# EAGLE design x50_dash (EAGLE 9.2.2)
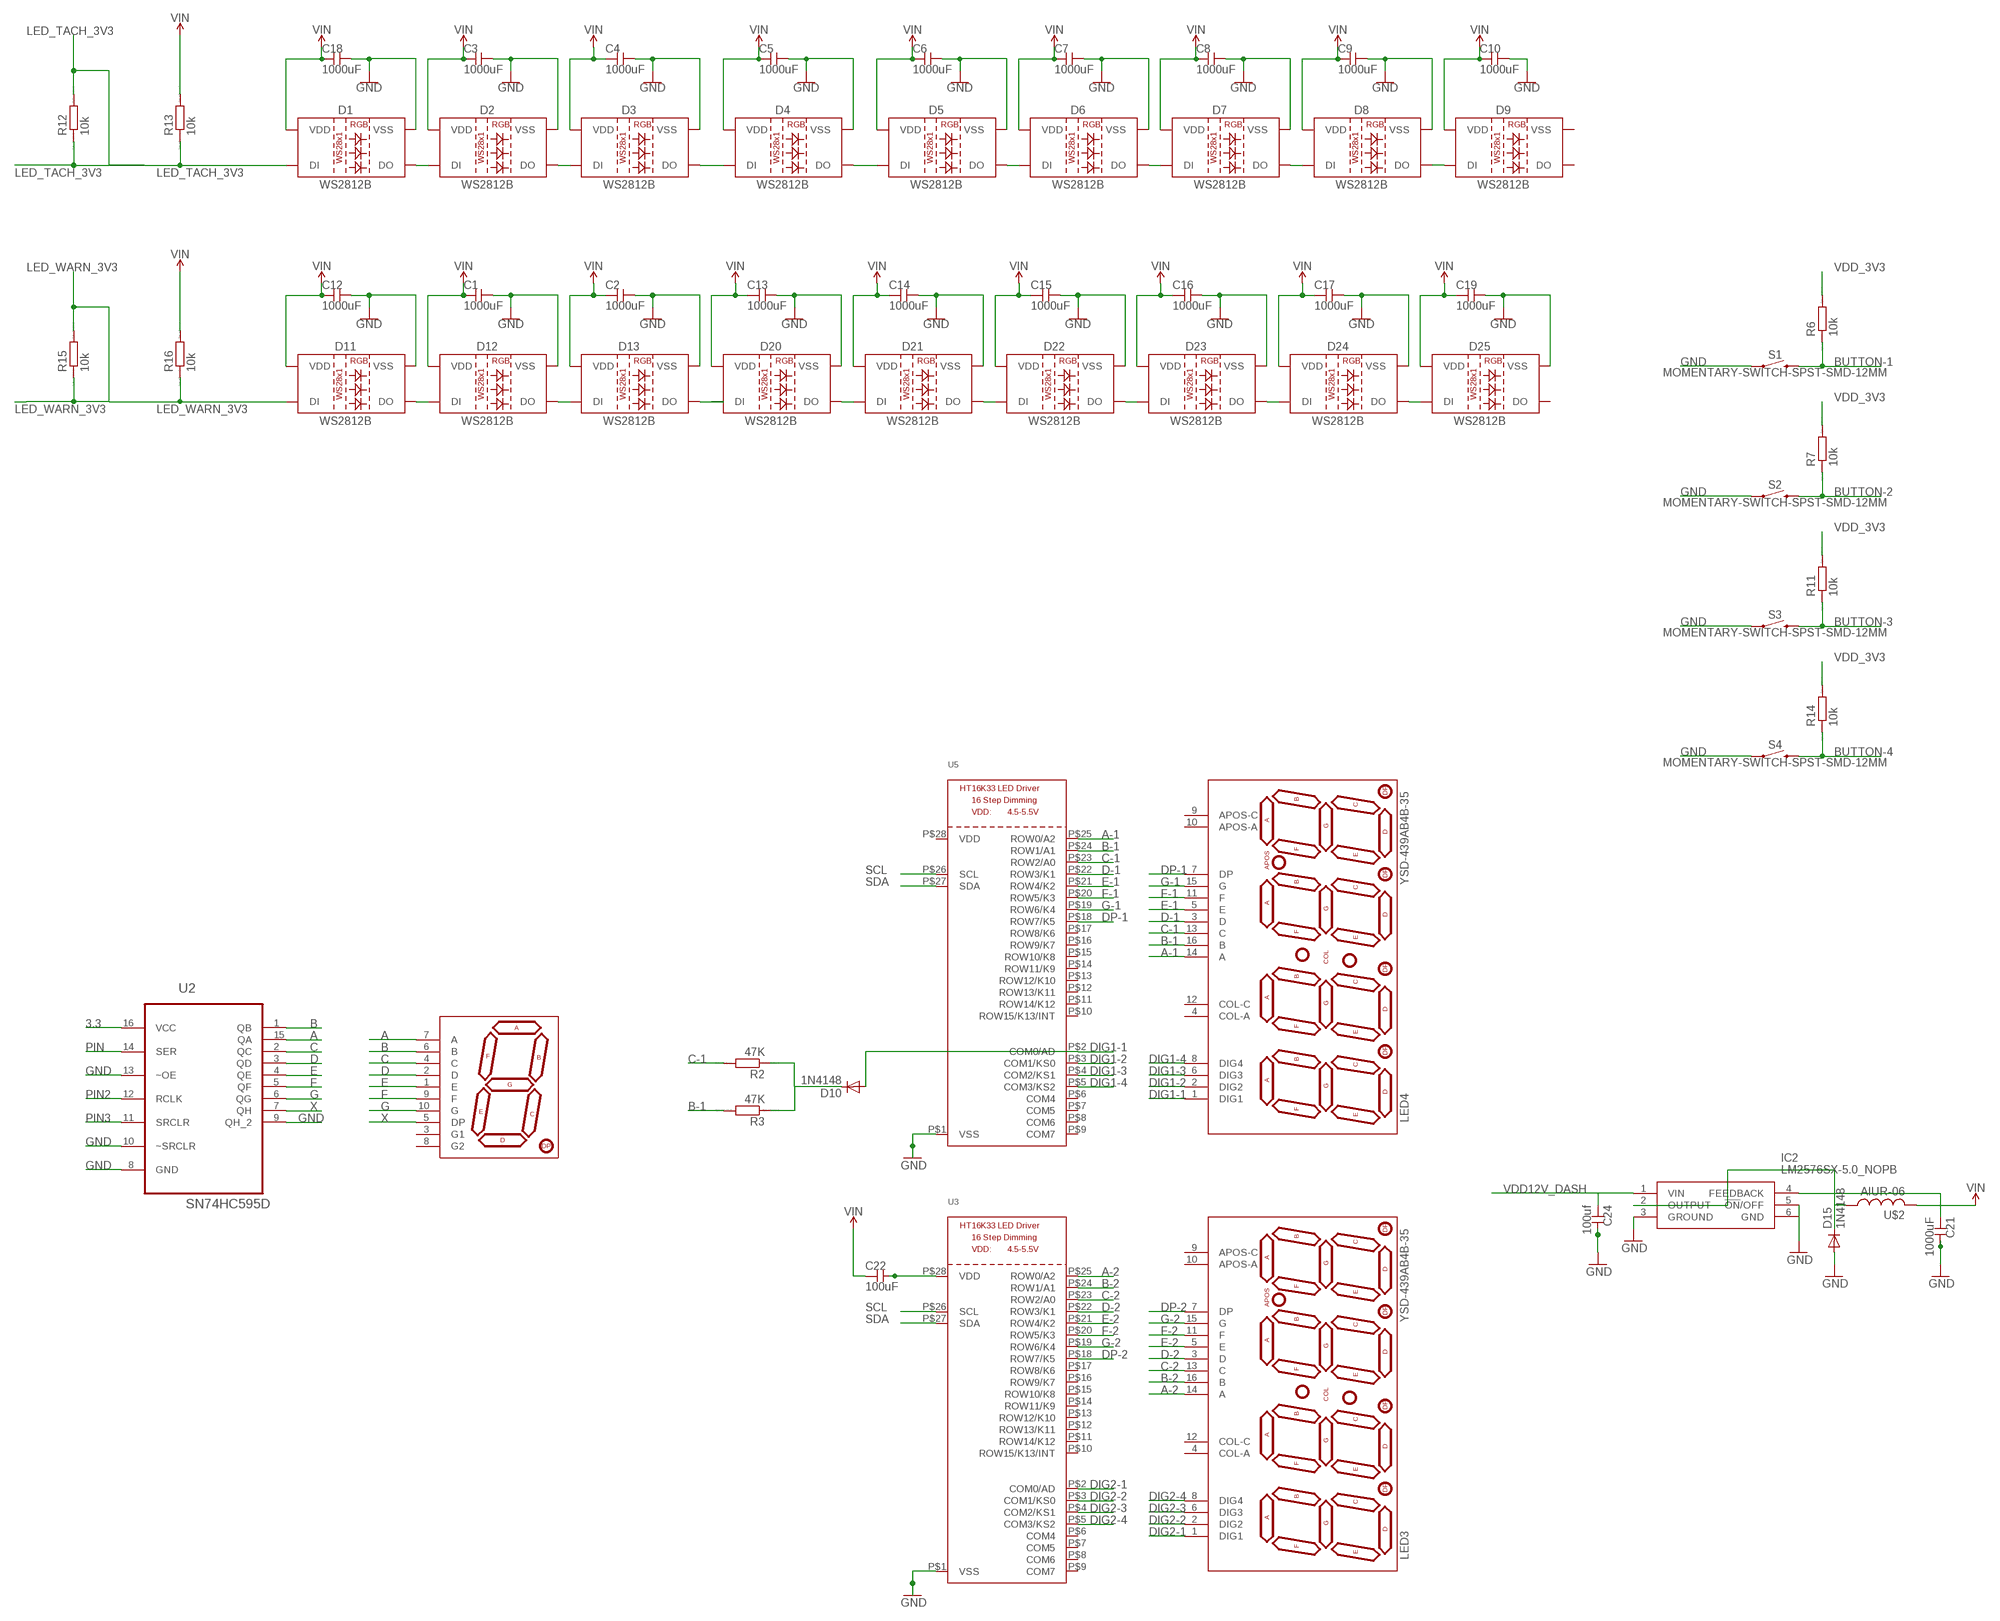
[diagram p0: schematic, sheet 1, part 1 of 2]
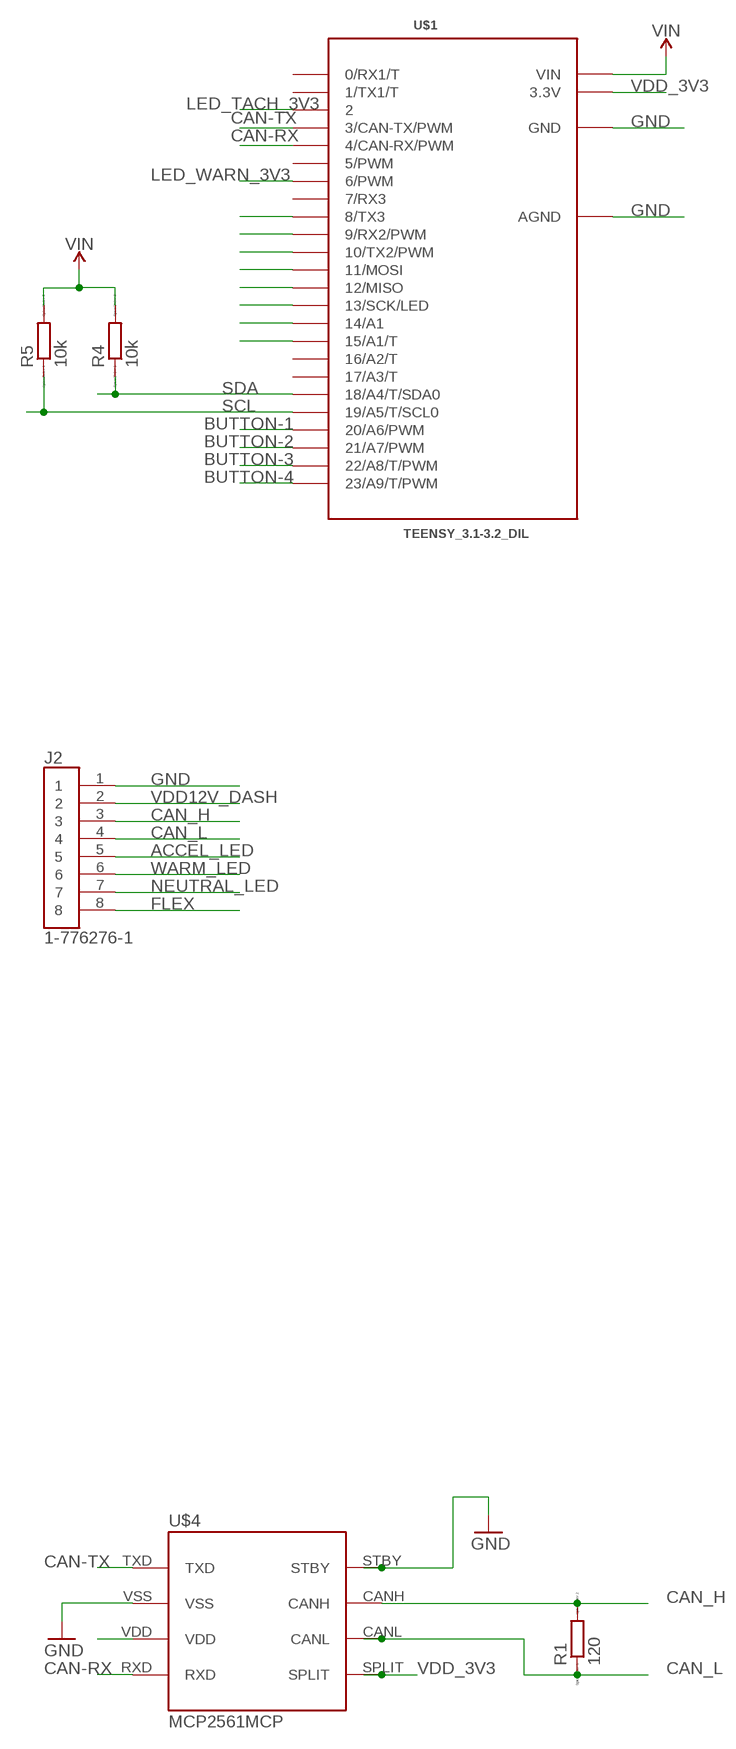
[diagram p1: schematic, sheet 1, part 2 of 2]

## Parts
C1  1000uF  CAP-1005  [1005]
C2  1000uF  CAP-1005  [1005]
C3  1000uF  CAP-1005  [1005]
C4  1000uF  CAP-1005  [1005]
C5  1000uF  CAP-1005  [1005]
C6  1000uF  CAP-1005  [1005]
C7  1000uF  CAP-1005  [1005]
C8  1000uF  CAP-1005  [1005]
C9  1000uF  CAP-1005  [1005]
C10  1000uF  CAP-1005  [1005]
C12  1000uF  CAP-1005  [1005]
C13  1000uF  CAP-1005  [1005]
C14  1000uF  CAP-1005  [1005]
C15  1000uF  CAP-1005  [1005]
C16  1000uF  CAP-1005  [1005]
C17  1000uF  CAP-1005  [1005]
C18  1000uF  CAP-1005  [1005]
C19  1000uF  CAP-1005  [1005]
C21  1000uF  CAP-1005  [1005]
C22  100uF  CAP-1005  [1005]
C24  100uf  CAP-1005  [1005]
D1  WS2812B  [WS2812B]
D2  WS2812B  [WS2812B]
D3  WS2812B  [WS2812B]
D4  WS2812B  [WS2812B]
D5  WS2812B  [WS2812B]
D6  WS2812B  [WS2812B]
D7  WS2812B  [WS2812B]
D8  WS2812B  [WS2812B]
D9  WS2812B  [WS2812B]
D10  1N4148  [DO35-10]
D11  WS2812B  [WS2812B]
D12  WS2812B  [WS2812B]
D13  WS2812B  [WS2812B]
D15  1N4148  [DO35-10]
D20  WS2812B  [WS2812B]
D21  WS2812B  [WS2812B]
D22  WS2812B  [WS2812B]
D23  WS2812B  [WS2812B]
D24  WS2812B  [WS2812B]
D25  WS2812B  [WS2812B]
IC2  LM2576SX-5.0_NOPB  [KTT0005B]
J2  1-776276-1  [TE_1-776276-1]
LED3  YSD-439AB4B-35  7-SEGMENT-4DIGIT-10MM-BLUE  [7-SEGMENT-4DIGIT-YOUNGSUN]
LED4  YSD-439AB4B-35  7-SEGMENT-4DIGIT-10MM-BLUE  [7-SEGMENT-4DIGIT-YOUNGSUN]
R1  120  R  [R0805]
R2  47K  R  [R0805]
R3  47K  R  [R0805]
R4  10k  R  [R0805]
R5  10k  R  [R0805]
R6  10k  R  [R0805]
R7  10k  R  [R0805]
R11  10k  R  [R0805]
R12  10k  R  [R0805]
R13  10k  R  [R0805]
R14  10k  R  [R0805]
R15  10k  R  [R0805]
R16  10k  R  [R0805]
S1  MOMENTARY-SWITCH-SPST-SMD-12MM  [TACTILE_SWITCH_SMD_12MM]
S2  MOMENTARY-SWITCH-SPST-SMD-12MM  [TACTILE_SWITCH_SMD_12MM]
S3  MOMENTARY-SWITCH-SPST-SMD-12MM  [TACTILE_SWITCH_SMD_12MM]
S4  MOMENTARY-SWITCH-SPST-SMD-12MM  [TACTILE_SWITCH_SMD_12MM]
U2  SN74HC595D  [SOIC127P600X175-16N]
U3  HT16K33_SOP28  [SOP28_300MIL]
U5  HT16K33_SOP28  [SOP28_300MIL]
U$1  TEENSY_3.1-3.2_DIL  [TEENSY_3.0-3.2&LC_DIL]
U$2  AIUR-06  [AIUR-06]
U$4  MCP2561MCP  [MCP2561_PDIP]
U$5  YSD-160AB3C-8  7-SEGMENT-1DIGIT-1INCH-BLUE  [7-SEGMENT-1"PTH]

## Nets
3.3: U2.16(VCC)
A: U2.15(QA) U$5.7(A)
A-1: LED4.14(A) U5.P$25(ROW0/A2)
A-2: LED3.14(A) U3.P$25(ROW0/A2)
ACCEL_LED: J2.5
B: U2.1(QB) U$5.6(B)
B-1: LED4.16(B) R3.2 U5.P$24(ROW1/A1)
B-2: LED3.16(B) U3.P$24(ROW1/A1)
BUTTON-1: R6.1 S1.3 U$1.20/A6(20/A6/PWM)
BUTTON-2: R7.1 S2.3 U$1.21/A7(21/A7/PWM)
BUTTON-3: R11.1 S3.3 U$1.22/A8(22/A8/T/PWM)
BUTTON-4: R14.1 S4.3 U$1.23/A9(23/A9/T/PWM)
C: U2.2(QC) U$5.4(C)
C-1: LED4.13(C) R2.2 U5.P$23(ROW2/A0)
C-2: LED3.13(C) U3.P$23(ROW2/A0)
CAN-RX: U$1.4(4/CAN-RX/PWM) U$4.RXD U$4.VDD
CAN-TX: U$1.3(3/CAN-TX/PWM) U$4.TXD
CAN_H: J2.3 R1.2 U$4.CANH
CAN_L: J2.4 R1.1 U$4.CANL
D: U2.3(QD) U$5.2(D)
D-1: LED4.3(D) U5.P$22(ROW3/K1)
D-2: LED3.3(D) U3.P$22(ROW3/K1)
DIG1-1: D10.A LED4.1(DIG1) U5.P$2(COM0/AD)
DIG1-2: LED4.2(DIG2) U5.P$3(COM1/KS0)
DIG1-3: LED4.6(DIG3) U5.P$4(COM2/KS1)
DIG1-4: LED4.8(DIG4) U5.P$5(COM3/KS2)
DIG2-1: LED3.1(DIG1) U3.P$2(COM0/AD)
DIG2-2: LED3.2(DIG2) U3.P$3(COM1/KS0)
DIG2-3: LED3.6(DIG3) U3.P$4(COM2/KS1)
DIG2-4: LED3.8(DIG4) U3.P$5(COM3/KS2)
DP-1: LED4.7(DP) U5.P$18(ROW7/K5)
DP-2: LED3.7(DP) U3.P$18(ROW7/K5)
E: U2.4(QE) U$5.1(E)
E-1: LED4.5(E) U5.P$21(ROW4/K2)
E-2: LED3.5(E) U3.P$21(ROW4/K2)
F: U2.5(QF) U$5.9(F)
F-1: LED4.11(F) U5.P$20(ROW5/K3)
F-2: LED3.11(F) U3.P$20(ROW5/K3)
FLEX: J2.8
G: U2.6(QG) U$5.10(G)
G-1: LED4.15(G) U5.P$19(ROW6/K4)
G-2: LED3.15(G) U3.P$19(ROW6/K4)
GND: C1.P$2 C2.P$2 C3.P$2 C4.P$2 C5.P$2 C6.P$2 C7.P$2 C8.P$2 C9.P$2 C10.P$2 C12.P$2 C13.P$2 C14.P$2 C15.P$2 C16.P$2 C17.P$2 C18.P$2 C19.P$2 C21.P$2 C24.P$2 D1.3(VSS) D2.3(VSS) D3.3(VSS) D4.3(VSS) D5.3(VSS) D6.3(VSS) D7.3(VSS) D8.3(VSS) D11.3(VSS) D12.3(VSS) D13.3(VSS) D15.A D20.3(VSS) D21.3(VSS) D22.3(VSS) D23.3(VSS) D24.3(VSS) D25.3(VSS) IC2.3(GROUND) IC2.5(!ON!/OFF) IC2.6(GND) J2.1 S1.1 S2.1 S3.1 S4.1 U2.8(GND) U2.9(QH_2) U2.10(~SRCLR) U2.13(~OE) U3.P$1(VSS) U5.P$1(VSS) U$1.AGND U$1.GND U$4.STBY U$4.VSS
LED_TACH_3V3: D1.4(DI) R12.1 R12.2 R13.1 U$1.2
LED_WARN_3V3: D11.4(DI) R15.1 R15.2 R16.1 U$1.6(6/PWM)
MISO: U$1.12(12/MISO)
MOSI: U$1.11(11/MOSI)
N$1: D10.C R2.1 R3.1
N$2: D1.2(DO) D2.4(DI)
N$4: C22.P$2 U3.P$28(VDD)
N$5: D12.2(DO) D13.4(DI)
N$6: D7.2(DO) D8.4(DI)
N$7: D8.2(DO) D9.4(DI)
N$10: D13.2(DO)
N$11: D11.2(DO) D12.4(DI)
N$12: D15.C IC2.2(OUTPUT) U$2.P$1
N$13: D2.2(DO) D3.4(DI)
N$14: D3.2(DO) D4.4(DI)
N$15: D4.2(DO) D5.4(DI)
N$16: D5.2(DO) D6.4(DI)
N$17: D6.2(DO) D7.4(DI)
N$20: D20.4(DI)
N$21: D20.2(DO) D21.4(DI)
N$22: D21.2(DO) D22.4(DI)
N$23: D22.2(DO) D23.4(DI)
N$24: D23.2(DO) D24.4(DI)
N$25: D24.2(DO) D25.4(DI)
NEUTRAL_LED: J2.7
OLED_CS: U$1.10(10/TX2/PWM)
OLED_DC: U$1.15/A1(15/A1/T)
OLED_RESET: U$1.14/A0(14/A1)
PIN: U2.14(SER)
PIN2: U2.12(RCLK)
PIN3: U2.11(SRCLR)
SCK: U$1.13(13/SCK/LED)
SCL: R5.1 U3.P$26(SCL) U5.P$26(SCL) U$1.19/A5(19/A5/T/SCL0)
SDA: R4.1 U3.P$27(SDA) U5.P$27(SDA) U$1.18/A4(18/A4/T/SDA0)
SDCARD_CD: U$1.8(8/TX3)
SDCARD_CS: U$1.9(9/RX2/PWM)
VDD12V_DASH [pwr]: C24.P$1 IC2.1(VIN) J2.2
VDD_3V3: R6.2 R7.2 R11.2 R14.2 U$1.3.3V U$4.SPLIT
VIN [pwr]: C1.P$1 C2.P$1 C3.P$1 C4.P$1 C5.P$1 C6.P$1 C7.P$1 C8.P$1 C9.P$1 C10.P$1 C12.P$1 C13.P$1 C14.P$1 C15.P$1 C16.P$1 C17.P$1 C18.P$1 C19.P$1 C21.P$1 C22.P$1 D1.1(VDD) D2.1(VDD) D3.1(VDD) D4.1(VDD) D5.1(VDD) D6.1(VDD) D7.1(VDD) D8.1(VDD) D9.1(VDD) D11.1(VDD) D12.1(VDD) D13.1(VDD) D20.1(VDD) D21.1(VDD) D22.1(VDD) D23.1(VDD) D24.1(VDD) D25.1(VDD) IC2.4(FEEDBACK) R4.2 R5.2 R13.2 R16.2 U$1.VIN U$2.P$2
WARM_LED: J2.6
X: U2.7(QH) U$5.5(DP)
Unconnected: D9.2(DO) D9.3(VSS) D25.2(DO) LED3.4(COL-A) LED3.9(APOS-C) LED3.10(APOS-A) LED3.12(COL-C) LED4.4(COL-A) LED4.9(APOS-C) LED4.10(APOS-A) LED4.12(COL-C) U3.P$6(COM4) U3.P$7(COM5) U3.P$8(COM6) U3.P$9(COM7) U3.P$10(ROW15/K13/INT) U3.P$11(ROW14/K12) U3.P$12(ROW13/K11) U3.P$13(ROW12/K10) U3.P$14(ROW11/K9) U3.P$15(ROW10/K8) U3.P$16(ROW9/K7) U3.P$17(ROW8/K6) U5.P$6(COM4) U5.P$7(COM5) U5.P$8(COM6) U5.P$9(COM7) U5.P$10(ROW15/K13/INT) U5.P$11(ROW14/K12) U5.P$12(ROW13/K11) U5.P$13(ROW12/K10) U5.P$14(ROW11/K9) U5.P$15(ROW10/K8) U5.P$16(ROW9/K7) U5.P$17(ROW8/K6) U5.P$28(VDD) U$1.0(0/RX1/T) U$1.1(1/TX1/T) U$1.5(5/PWM) U$1.7(7/RX3) U$1.16/A2(16/A2/T) U$1.17/A3(17/A3/T) U$5.3(G1) U$5.8(G2)

## Library data of the parts
C1-C10 C12-C19 C21 C22 C24 = scenix4:CAP-1005
D1-D9 D11-D13 D20-D25 = SparkFun-LED:WS2812B: WS2812B SMD addressable RGB LED 5x5mm SMD LED with built-in controller IC. Color: Red/Green/Blue mC Rating: RGB: 390, 660, 180 mcd Forward Voltage: RGB: 2.0, 3.0, 3.0 V Packages:WS2812B SparkFun Products: Blynk Board - ESP8266 <https://www.sparkfun.com/products/13794>; PROD_ID: DIO-12503
D10 D15 = diode:1N4148: DIODE high speed (Philips)
IC2 = V_REG:LM2576SX-5.0_NOPB: SIMPLE SWITCHER® 40V, 3A Low Component Count Step-Down Regulator Source: Datasheet <http://www.ti.com/lit/gpn/lm2576>; DESCRIPTION: SIMPLE SWITCHER&#174; 40V, 3A Low Component Count Step-Down Regulator; HEIGHT: mm; MANUFACTURER_NAME: Texas Instruments; MANUFACTURER_PART_NUMBER: LM2576SX-5.0/NOPB; MOUSER_PART_NUMBER: 926-LM2576SX-5.0NOPB; MOUSER_PRICE-STOCK: https://www.mouser.com/Search/Refine.aspx?Keyword=926-LM2576SX-5.0NOPB
J2 = 1-776276-1:1-776276-1: CONN HEADER 8POS VERT GOLD BLK; MANUFACTURER: TE Connectivity; METADATA: Manufacturer recommendations; PARTREV: B9; SPICEPREFIX: X
LED3 LED4 = SparkFun-LED:7-SEGMENT-4DIGIT-10MM: 4 Digit 7 Segment Display This is a part for the 4-Digit 7-segment LEDs from Young Sun. Different from the Digikey LEDs, all 16 pins are used. The LONGPADS Variant is used for a test jig, but you may like it because there is more pad to solder to. If you are concerned about routing space, the standard works just fine though. Datasheets: Red <http://www.sparkfun.com/datasheets/Components/LED/7-Segment/YSD-439AR6B-35.pdf> Yellow <http://www.sparkfun.com/datasheets/Components/LED/7-Segment/YSD-439AY2B-35.pdf> Kelly Green <http://www.sparkfun.com/datasheets/Components/LED/7-Segment/YSD-439AK2B-35.pdf> Blue <http://www.sparkfun.com/datasheets/Components/LED/7-Segment/YSD-439AB4B-35.pdf> White <http://cdn.sparkfun.com/datasheets/Components/LED/ATA3492BW_2.pdf> SparkFun Products Raw Components 7-Segment Display - 4-Digit (Red) <https://www.sparkfun.com/products/9483> (COM-09483) 7-Segment Display - 4-Digit (Yellow) <https://www.sparkfun.com/products/9480> (COM-09480) 7-Segment Display - 4-Digit (Kelly Green) <https://www.sparkfun.com/products/9482> (COM-09482) 7-Segment Display - 4-Digit (Blue) <https://www.sparkfun.com/products/9481> (COM-09481) 7-Segment Display - 4-Digit (White) <https://www.sparkfun.com/products/10931> ( COM-10931) Serial Controlled SparkFun 7-Segment Serial Display - Red <https://www.sparkfun.com/products/11441> (COM-11441) SparkFun 7-Segment Serial Display - Yellow <https://www.sparkfun.com/products/11443> (COM-11443) SparkFun 7-Segment Serial Display - Kelly Green <https://www.sparkfun.com/products/11440> (COM-11440) SparkFun 7-Segment Serial Display - Blue <https://www.sparkfun.com/products/11442> (COM-11442) SparkFun 7-Segment Serial Display - White <https://www.sparkfun.com/products/11629> (COM-11629) Other SparkFun BigTime Watch Kit <https://www.sparkfun.com/products/11734> (KIT-11734); PROD_ID: COMP-09664
R1-R7 R11-R16 = eagle-ltspice:R: RESISTOR, European symbol; SPICEMODEL: NONE; SPICEPREFIX: R
S1-S4 = SparkFun-Switches:MOMENTARY-SWITCH-SPST: Momentary Switch (Pushbutton) - SPST Normally-open (NO) SPST momentary switches (buttons, pushbuttons). Variants PTH-12MM - 12mm square, through-hole Momentary Pushbutton Switch - 12mm Square <https://www.sparkfun.com/products/9190> (COM-09190) PTH-6.0MM, PTH-6.0MM-KIT - 6.0mm square, through-hole Mini Pushbutton Switch <https://www.sparkfun.com/products/97> (COM-00097) KIT package intended for soldering kit's - only one side of pads' copper is exposed. PTH-RIGHT-ANGLE-KIT - Right-angle, through-hole Right Angle Tactile Button <https://www.sparkfun.com/products/10791> - Used on SparkFun BigTime Watch Kit <https://www.sparkfun.com/products/11734> SMD-12MM - 12mm square, surface-mount Tactile Button - SMD (12mm) <https://www.sparkfun.com/products/12993> (COM-12993) Used on SparkFun PicoBoard <https://www.sparkfun.com/products/11888> SMD-4.5MM - 4.5mm Square Trackball Switch Used on SparkFun Blackberry Trackballer Breakout <https://www.sparkfun.com/products/13169> SMD-4.6MMX2.8MM - 4.60mm x 2.80mm, surface mount Used on SparkFun SAMD21 Mini Breakout <https://www.sparkfun.com/products/13664> SMD-5.2MM, SMD-5.2-REDUNDANT - 5.2mm square, surface-mount Mini Pushbutton Switch - SMD <https://www.sparkfun.com/products/8720> (COM-08720) Used on Arduino Pro Mini <https://www.sparkfun.com/products/11114> REDUNDANT package connects both switch circuits together SMD-6.0X3.5MM - 6.0 x 3.5mm, surface mount Momentary Reset Switch SMD <https://www.sparkfun.com/products/8229> (COM-08229) SMD-6.2MM-TALL - 6.2mm square, surface mount Tactile Button - SMD (6mm) <https://www.sparkfun.com/products/12992> Used on SparkFun Digital Sandbox <https://www.sparkfun.com/products/12651> SMD-RIGHT-ANGLE - Right-angle, surface mount Used on SparkFun Block for Intel® Edison - Arduino <https://www.sparkfun.com/products/13036>; PROD_ID: SWCH-11967; SF_SKU: COM-12993
U2 = SN74HC595D:SN74HC595D: 8-BIT SHIFT REGISTERS WITH 3-STATE OUTPUT REGISTERS; DESCRIPTION: Shift Register Single 8-Bit Serial to Serial/Parallel 16-Pin SOIC Tube; DIGI-KEY_PART_NUMBER: 296-8344-5-ND; DIGI-KEY_PURCHASE_URL: https://www.digikey.com/product-detail/en/texas-instruments/SN74HC595D/296-8344-5-ND/376752?utm_source=snapeda&utm_medium=aggregator&utm_campaign=symbol; MF: Texas Instruments; MP: SN74HC595D; PACKAGE: SOIC-16 Texas Instruments
U3 U5 = microbuilder:HT16K33_SOP28
U$1 = Teensy_3_and_LC_Series_Boards_v1.4:TEENSY_3.1-3.2_DIL: Teensy 3.1 or 3.2 in a DIL Layout.
U$2 = AIUR-06:AIUR-06
U$4 = PoJD:MCP2561: High-Speed CAN Transceiver See http://ww1.microchip.com/downloads/en/DeviceDoc/25167A.pdf The MCP2561/2 is a Microchip Technology Inc. second generation high-speed CAN transceiver. It serves as an interface between a CAN protocol controller and the physical two-wire CAN bus. The device meets the automotive requirements for high-speed (up to 1 Mb/s), low quiescent current, electromagnetic compatibility (EMC) and electrostatic discharge (ESD).
U$5 = SparkFun-LED:7-SEGMENT-1DIGIT-1INCH: 7-Segment Display, single digit, 1" EZ is for kits. Pads are only exposed on the bottom side to help prevent soldering in upside down. Datasheet (Red) <https://cdn.sparkfun.com/datasheets/Components/LED/YSD-160AR4B-8.pdf> Datasheet (Blue) <https://cdn.sparkfun.com/datasheets/Components/LED/YSD-160AB3C-8.pdf> SparkFun Products 7-Segment Display - LED (Red) <https://www.sparkfun.com/products/8546> (COM-08546) 7-Segment Display - LED (Blue) <https://www.sparkfun.com/products/9191> (COM-09191); PROD_ID: COMP-09495

## Net classes
0 default: width 0.254 mm, drill 0.55 mm
1 pwr: width 0.508 mm, drill 0.55 mm

## Board
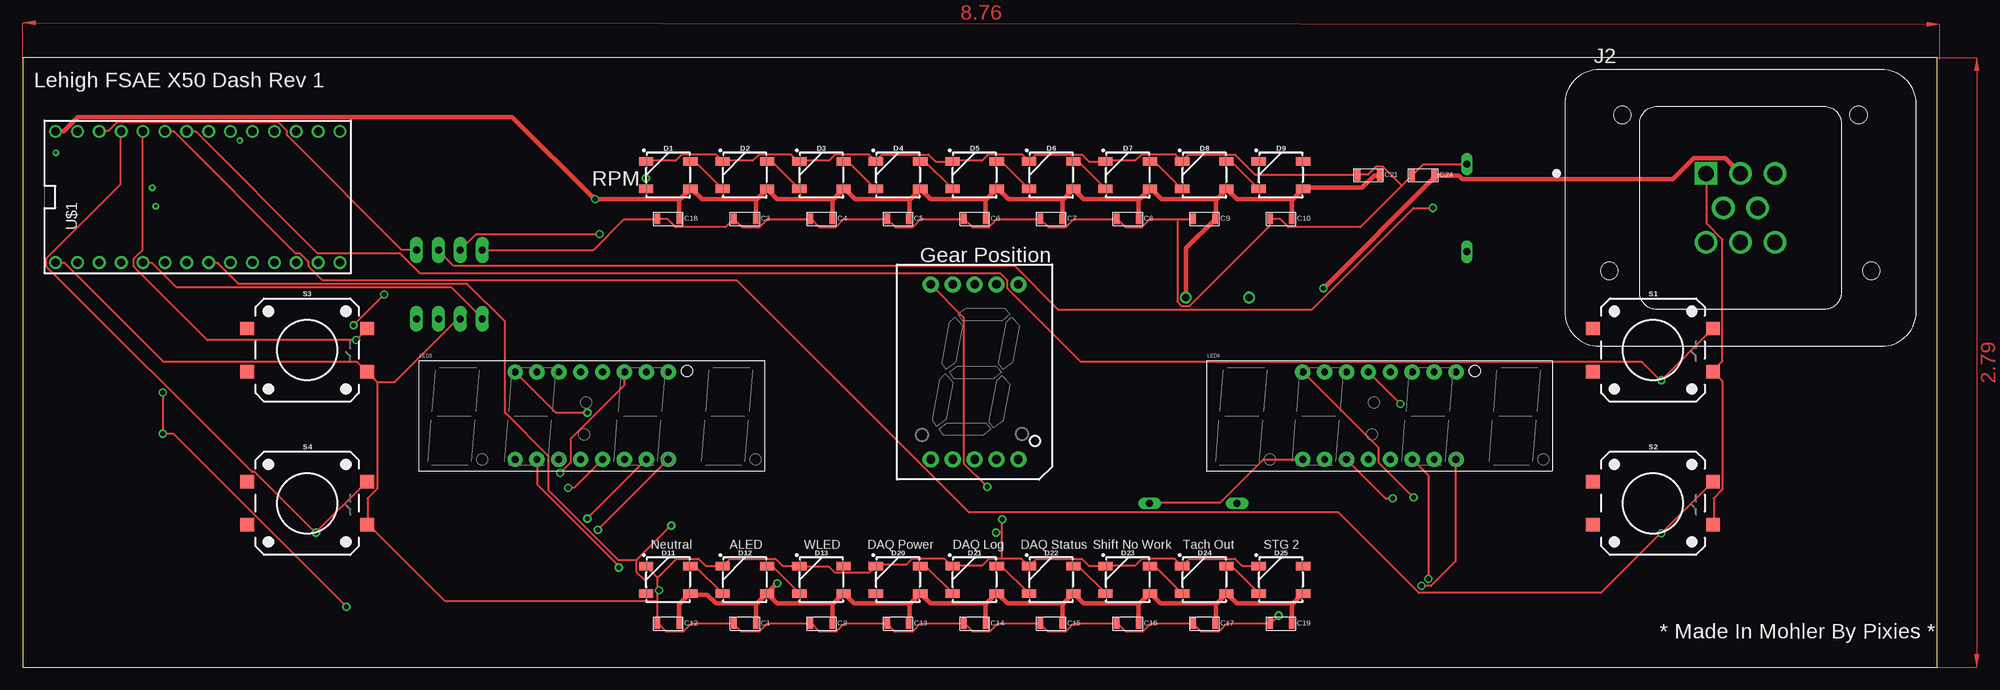
[diagram p2: board, top side]
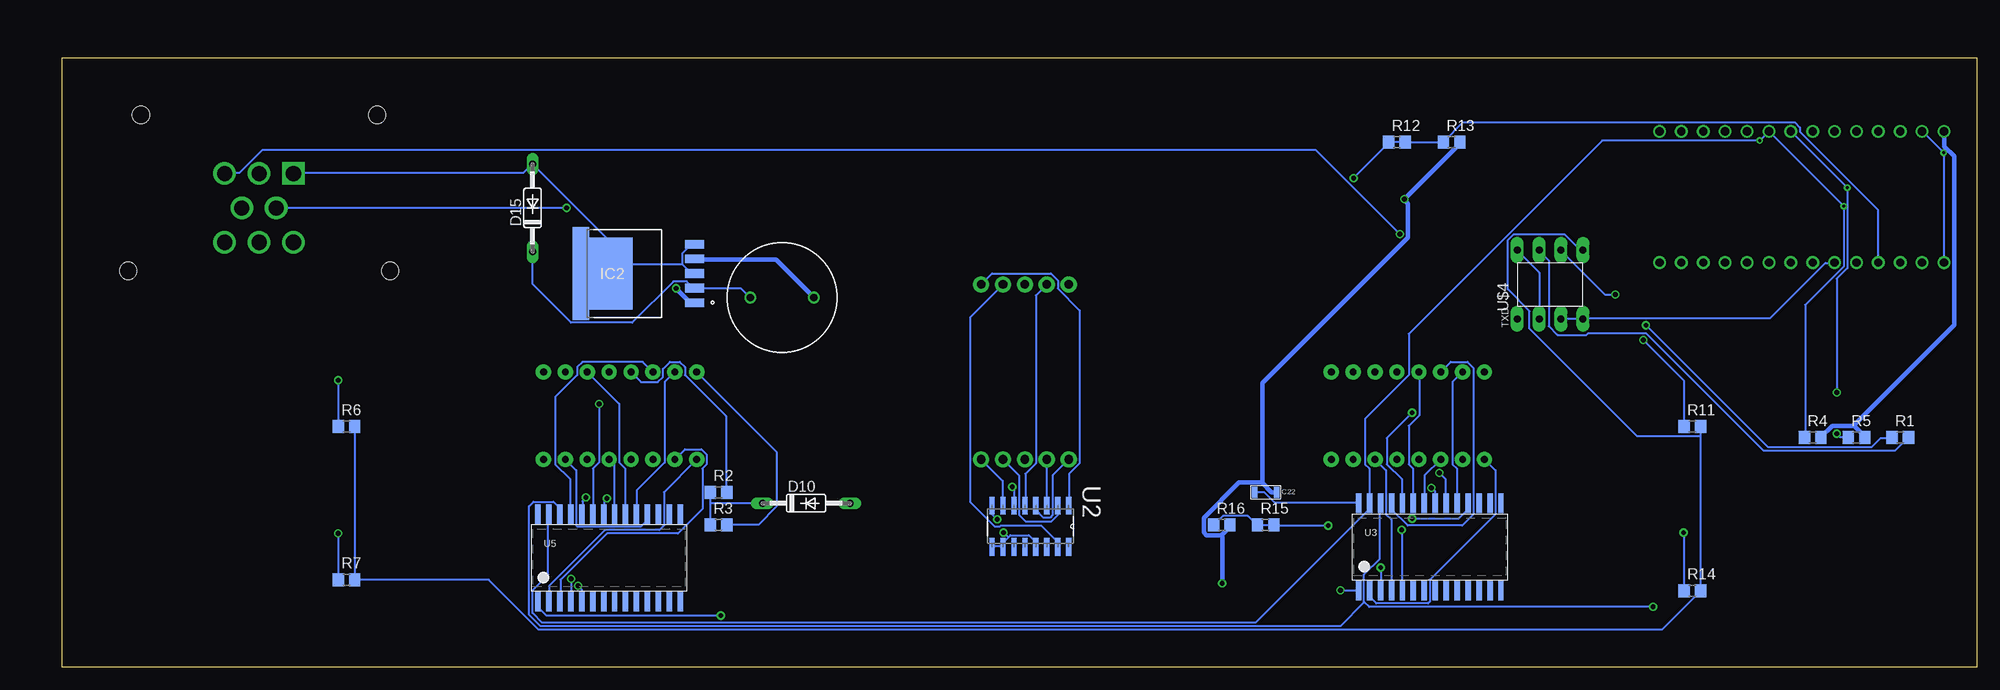
[diagram p3: board, bottom side, seen from below]

Size 222.23 x 70.79 mm. Coordinates in mm from the lower left corner, seen from the top.
Outline: 0,0 222.23,0 222.23,70.79 0,70.79 0,0
Copper layers (1*16): Top 0.035mm / dielectric 1.5mm / Bottom 0.035mm
Design rules "default": minimum track width 6mil, minimum drill 0.35mm, track to track 6mil, track to pad 6mil, pad to pad 6mil, via to via 6mil, smd to smd 6mil, copper to edge 40mil, drill to drill 6mil, minimum pad ring 10mil, minimum via ring 8mil, stop-mask expansion 4mil, vias tented up to drill 0mil, thermal gap 10mil

### Footprints (pad centres in the part's own frame; a part is rotated, then mirrored left to right if it is on the bottom)
1005 = smd 0.635 x 1.27: P$1 1.27,0; P$2 -1.27,0
WS2812B = smd 1.651 x 1: 1 2.577,-1.6; 2 2.577,1.6; 3 -2.577,1.6; 4 -2.577,-1.6
DO35-10 = drill 0.813 long: A 5.08,0; C -5.08,0
KTT0005B = smd 2.16 x 1.02: 1 12.461,-3.4; 2 12.461,-1.7; 3 12.461,0; 4 12.461,1.7; 5 12.461,3.4 | smd 6.99 x 8.33: 6 1.786,0 | smd 1.91 x 1.235: 7 -0.754,4.782; 8 -0.754,-4.782
TE_1-776276-1 = drill 1.75 square: 1 -4,4 | drill 1.75: 2 0,4; 3 4,4; 4 -2,0; 5 2,0; 6 -4,-4; 7 0,-4; 8 4,-4 | hole 2: -13.7,10.8; 13.7,10.8; -15.2,-7.3; 15.2,-7.3
7-SEGMENT-4DIGIT-YOUNGSUN = drill 0.8 pad 1.778: 1 -8.89,-5.08; 2 -6.35,-5.08; 3 -3.81,-5.08; 4 -1.27,-5.08; 5 1.27,-5.08; 6 3.81,-5.08; 7 6.35,-5.08; 8 8.89,-5.08; 9 8.89,5.08; 10 6.35,5.08; 11 3.81,5.08; 12 1.27,5.08; 13 -1.27,5.08; 14 -3.81,5.08; 15 -6.35,5.08; 16 -8.89,5.08
R0805 = smd 1.3 x 1.5: 1 -0.95,0; 2 0.95,0
TACTILE_SWITCH_SMD_12MM = smd 1.6 x 1.55: 1 6.975,-2.5; 2 -6.975,-2.5; 3 6.975,2.5; 4 -6.975,2.5
SOIC127P600X175-16N = smd 2.057 x 0.61: 1 -4.801,8.89; 2 -4.801,7.62; 3 -4.801,6.35; 4 -4.801,5.08; 5 -4.801,3.81; 6 -4.801,2.54; 7 -4.801,1.27; 8 -4.801,0; 9 0,0; 10 0,1.27; 11 0,2.54; 12 0,3.81; 13 0,5.08; 14 0,6.35; 15 0,7.62; 16 0,8.89
SOP28_300MIL = smd 0.635 x 2.286: P$1 -8.255,-5.08; P$2 -6.985,-5.08; P$3 -5.715,-5.08; P$4 -4.445,-5.08; P$5 -3.175,-5.08; P$6 -1.905,-5.08; P$7 -0.635,-5.08; P$8 0.635,-5.08; P$9 1.905,-5.08; P$10 3.175,-5.08; P$11 4.445,-5.08; P$12 5.715,-5.08; P$13 6.985,-5.08; P$14 8.255,-5.08; P$15 8.255,5.08; P$16 6.985,5.08; P$17 5.715,5.08; P$18 4.445,5.08; P$19 3.175,5.08; P$20 1.905,5.08; P$21 0.635,5.08; P$22 -0.635,5.08; P$23 -1.905,5.08; P$24 -3.175,5.08; P$25 -4.445,5.08; P$26 -5.715,5.08; P$27 -6.985,5.08; P$28 -8.255,5.08
TEENSY_3.0-3.2&LC_DIL = drill 0.965: 0 -7.62,13.97; 1 -7.62,11.43; 2 -7.62,8.89; 3 -7.62,6.35; 3.3V 7.62,11.43; 4 -7.62,3.81; 5 -7.62,1.27; 6 -7.62,-1.27; 7 -7.62,-3.81; 8 -7.62,-6.35; 9 -7.62,-8.89; 10 -7.62,-11.43; 11 -7.62,-13.97; 12 -7.62,-16.51; 13 7.62,-16.51; 14/A0 7.62,-13.97; 15/A1 7.62,-11.43; 16/A2 7.62,-8.89; 17/A3 7.62,-6.35; 18/A4 7.62,-3.81; 19/A5 7.62,-1.27; 20/A6 7.62,1.27; 21/A7 7.62,3.81; 22/A8 7.62,6.35; 23/A9 7.62,8.89; AGND 7.62,13.97; GND -7.62,16.51; VIN 7.62,16.51
AIUR-06 = drill 0.85: P$1 -3.685,0; P$2 3.685,0
MCP2561_PDIP = drill 0.813 pad 1.524 long: CANH 4,1.27; CANL 4,-1.27; RXD -4,-3.81; SPLIT 4,-3.81; STBY 4,3.81; TXD -4,3.81; VDD -4,-1.27; VSS -4,1.27
7-SEGMENT-1"PTH = drill 1 pad 1.88: 1 -5.08,-10.16; 2 -2.54,-10.16; 3 0,-10.16; 4 2.54,-10.16; 5 5.08,-10.16; 6 5.08,10.16; 7 2.54,10.16; 8 0,10.16; 9 -2.54,10.16; 10 -5.08,10.16

### Placement (x,y rotation side)
C1  83.82,5.08 0 top
C2  92.71,5.08 0 top
C3  83.82,52.07 0 top
C4  92.71,52.07 0 top
C5  101.6,52.07 0 top
C6  110.49,52.07 0 top
C7  119.38,52.07 0 top
C8  128.27,52.07 0 top
C9  137.16,52.07 0 top
C10  146.05,52.07 0 top
C12  74.93,5.08 0 top
C13  101.6,5.08 0 top
C14  110.49,5.08 0 top
C15  119.38,5.08 0 top
C16  128.27,5.08 0 top
C17  137.16,5.08 0 top
C18  74.93,52.07 0 top
C19  146.05,5.08 0 top
C21  156.21,57.15 0 top
C22  82.55,20.32 0 bottom
C24  162.56,57.15 0 top
D1  74.93,57.15 0 top
D2  83.82,57.15 0 top
D3  92.71,57.15 0 top
D4  101.6,57.15 0 top
D5  110.49,57.15 0 top
D6  119.38,57.15 0 top
D7  128.27,57.15 0 top
D8  137.16,57.15 0 top
D9  146.05,57.15 0 top
D10  135.89,19.05 0 bottom
D11  74.93,10.16 0 top
D12  83.82,10.16 0 top
D13  92.71,10.16 0 top
D15  167.64,53.34 90 bottom
D20  101.6,10.16 0 top
D21  110.49,10.16 0 top
D22  119.38,10.16 0 top
D23  128.27,10.16 0 top
D24  137.16,10.16 0 top
D25  146.05,10.16 0 top
IC2  161.29,45.72 0 bottom
J2  199.39,53.34 0 top
LED3  66.04,29.21 0 top
LED4  157.48,29.21 0 top
R1  8.89,26.67 0 bottom
R2  146.05,20.32 0 bottom
R3  146.05,16.51 0 bottom
R4  19.05,26.67 0 bottom
R5  13.97,26.67 0 bottom
R6  189.23,27.94 0 bottom
R7  189.23,10.16 0 bottom
R11  33.02,27.94 0 bottom
R12  67.31,60.96 0 bottom
R13  60.96,60.96 0 bottom
R14  33.02,8.89 0 bottom
R15  82.55,16.51 0 bottom
R16  87.63,16.51 0 bottom
S1  189.23,36.83 0 top
S2  189.23,19.05 0 top
S3  33.02,36.83 0 top
S4  33.02,19.05 0 top
U2  114.3,13.97 270 bottom
U3  63.5,13.97 0 bottom
U5  158.75,12.7 0 bottom
U$1  20.32,54.61 90 top
U$2  138.68,42.93 0 bottom
U$4  49.53,44.45 90 bottom
U$5  110.49,34.29 0 top

### Tracks (layer width: path | path; a pad name or v marks a point on that pad's centre or on a via)
A
  Bottom 0.254: U2.15 106.68,14.53 108.61,16.46 113.28,16.46 113.39,16.36 114,16.36 116.84,19.2 116.84,40.64 U$5.7
A-1
  Bottom 0.254: LED4.14 154.84,35.46 161.85,35.46 162.46,34.85 162.46,33.93 165,31.39 165,23.57 163.27,21.84 163.27,17.78 U5.P$25
A-2
  Bottom 0.254: LED3.14 61.06,35.46 59.13,35.46 58.42,34.75 58.42,17.78 59.74,16.46 66.04,16.46 67.87,18.29 67.87,19 U3.P$25
B
  Bottom 0.254: U$5.6 114.3,45.72 107.49,45.72 106.68,44.91 106.68,43.99 104.14,41.45 104.14,23.67 105.36,22.45 105.36,18.8 U2.1
B-1  (via drill 0.55)
  Top 0.254: v161.44,19.71 157.38,23.77 157.38,25.5 LED4.16
  Bottom 0.254: LED4.16 139.29,24.99 139.29,18.69 141.43,16.56 145.09,16.56 R3.2 | v161.44,19.71 161.85,19.3 161.85,17.78 U5.P$24
B-2  (via drill 0.55)
  Top 0.254: v65.53,29.57 61.87,29.57 LED3.16
  Bottom 0.254: v65.53,29.57 68.48,26.62 68.48,23.57 66.75,21.84 66.75,19.1 U3.P$24
BUTTON-1  (via drill 0.35, 0.55)
  Top 0.254: S1.3 v190.19,33.33 190.09,33.33 187.96,35.46 122.83,35.46 114.3,43.99 114.3,44.91 113.49,45.72 46.13,45.72 43.79,48.06 34.24,48.06 20.12,62.18 v19.1,62.18 U$1.20/A6
  Bottom 0.254: v190.19,33.33 190.19,27.94 R6.1
BUTTON-2  (via drill 0.35, 0.55)
  Top 0.254: S2.3 v190.19,15.54 190.09,15.54 183.19,8.64 162.05,8.64 152.71,17.98 109.83,17.98 82.91,44.91 34.85,44.91 33.22,46.53 33.22,47.04 32.21,48.06 31.7,48.06 17.58,62.18 v16.56,62.18 U$1.21/A7
  Bottom 0.254: v190.19,15.54 190.19,10.16 R7.1
BUTTON-3  (via drill 0.35, 0.55)
  Top 0.254: S3.3 40.03,39.32 v38.71,38 21.44,38 12.9,46.53 12.9,47.45 13.92,48.46 v13.92,62.18 U$1.22/A8
  Bottom 0.254: v38.71,38 34.04,33.33 34.04,27.94 R11.1
BUTTON-4  (via drill 0.35, 0.55)
  Top 0.254: S4.3 39.93,21.54 v34.04,15.65 33.93,15.65 26.92,22.66 26.62,22.66 2.74,46.53 2.74,47.45 11.38,56.08 v11.38,62.18 U$1.23/A9
  Bottom 0.254: v34.04,15.65 34.04,8.94 R14.1
C
  Bottom 0.254: U2.2 106.68,17.68 107.39,16.97 110.44,16.97 111.15,17.68 111.15,22.25 U$5.4
C-1  (via drill 0.55)
  Top 0.254: LED4.13 v159.92,30.58
  Bottom 0.254: LED4.13 155.04,33.12 153.11,33.12 152.5,33.73 152.5,34.65 151.69,35.46 150.57,35.46 149.96,34.85 149.96,33.93 145.19,29.16 145.19,20.32 R2.2 | v159.92,30.58 159.92,23.77 160.63,23.06 160.63,17.78 U5.P$23
C-2
  Bottom 0.254: U3.P$23 65.43,19.1 65.43,23.06 65.94,23.57 65.94,28.04 64.72,29.26 64.72,34.24 LED3.13
CAN-RX  (via drill 0.35)
  Bottom 0.254: U$1.4 v16.56,46.94 17.58,46.94 23.98,40.54 45.72,40.54 U$4.RXD 45.82,40.44 48.26,40.44 U$4.VDD
CAN-TX  (via drill 0.35)
  Top 0.254: U$1.3 v14.02,46.94 15.04,46.94 17.88,44.09 49.78,44.09 53.34,40.54 U$4.TXD
CAN_H  (via drill 0.35, 0.55)
  Top 0.254: v66.95,50.29 52.63,50.29 50.8,48.46 U$4.CANH
  Bottom 0.254: R1.2 8.03,26.62 9.45,25.2 24.79,25.2 38.41,38.81 45.11,38.81 45.31,38.61 48.67,38.61 49.68,39.62 49.68,47.24 50.8,48.36 U$4.CANH | v66.95,50.29 76.71,60.05 199.03,60.05 201.68,57.4 v203.3,57.4 J2.3
CAN_L  (via drill 0.55)
  Top 0.254: v41.96,43.28 v38.41,39.73 | v163.68,53.34 161.44,53.34 149.66,41.55 120.19,41.55 115.11,46.63 49.99,46.63 48.26,48.36 U$4.CANL
  Bottom 0.254: v38.41,39.73 24.28,25.6 12.19,25.6 11.18,26.62 9.86,26.62 R1.1 | v41.96,43.28 43.18,43.28 48.26,48.36 U$4.CANL | v163.68,53.34 J2.4
D
  Bottom 0.254: U2.3 108,18.8 108,24.08 U$5.2
D-1  (via drill 0.55)
  Top 0.254: v159,19.61 158.19,19.61 LED4.3
  Bottom 0.254: v159,19.61 159.31,19.3 159.31,17.78 U5.P$22
D-2
  Bottom 0.254: LED3.3 64.11,22.25 64.11,19.1 U3.P$22
DIG1-1
  Top 0.254: D10.A 130.86,19.1 138.99,19.1 143.97,24.08 148.54,24.08 LED4.1
  Bottom 0.254: LED4.1 152.4,20.32 152.4,16.46 152.91,15.95 159.21,15.95 165.71,9.45 165.71,7.62 U5.P$2
DIG1-2
  Bottom 0.254: LED4.2 149.96,25.3 148.03,25.3 147.42,24.69 147.42,23.57 147.93,23.06 147.93,18.39 150.77,15.54 159,15.54 164.39,10.16 164.39,7.62 U5.P$3
DIG1-3  (via drill 0.55)
  Top 0.254: v163.17,10.26 163.17,22.25 LED4.6
  Bottom 0.254: v163.17,10.26 163.17,7.62 U5.P$4
DIG1-4  (via drill 0.55)
  Top 0.254: v162.36,9.45 163.47,9.45 166.32,12.29 166.32,24.08 LED4.8
  Bottom 0.254: v162.36,9.45 161.95,9.04 161.95,7.62 U5.P$5
DIG2-1
  Bottom 0.254: LED3.1 55.88,22.86 55.88,17.78 63.5,10.16 63.5,7.62 63.7,7.42 69.7,7.42 70.41,8.13 70.41,8.84 U3.P$2
DIG2-2  (via drill 0.55)
  Top 0.254: v69.19,11.58 69.19,11.79 59.74,21.23 59.74,24.08 LED3.2
  Bottom 0.254: v69.19,11.58 69.19,8.94 U3.P$3
DIG2-3
  Bottom 0.254: LED3.6 68.58,22.86 68.58,17.78 67.97,17.17 67.97,8.94 U3.P$4
DIG2-4  (via drill 0.55)
  Top 0.254: LED3.8 v66.75,15.95
  Bottom 0.254: v66.75,15.95 66.75,8.94 U3.P$5
DP-1
  Bottom 0.254: LED4.7 162.56,22.86 162.56,16.46 162.46,16.36 155.04,16.36 154.33,17.07 154.33,17.78 U5.P$18
DP-2  (via drill 0.55)
  Top 0.254: LED3.7 v65.53,17.27
  Bottom 0.254: v65.53,17.27 60.15,17.27 59.13,18.29 59.13,19 U3.P$18
E
  Bottom 0.254: U2.4 109.22,18.29 108.31,17.37 107.59,17.37 107.29,17.68 107.29,22.25 U$5.1
E-1
  Bottom 0.254: LED4.5 158.19,23.57 158.19,17.78 U5.P$21
E-2  (via drill 0.55)
  Top 0.254: v63.3,20.83 64.01,20.83 LED3.5
  Bottom 0.254: v63.3,20.83 62.89,20.42 62.89,19.1 U3.P$21
F
  Bottom 0.254: U$5.9 109.22,43.18 109.22,23.67 110.44,22.45 110.44,18.8 U2.5
F-1
  Bottom 0.254: LED4.11 157.58,30.58 157.58,23.77 156.87,23.06 156.87,17.78 U5.P$20
F-2  (via drill 0.55)
  Top 0.254: v62.38,22.55 63.6,23.77 63.6,26.52 69.8,32.72 69.8,34.24 LED3.11
  Bottom 0.254: v62.38,22.55 61.67,21.84 61.67,19.1 U3.P$20
G  (via drill 0.55)
  Top 0.254: v111.96,20.93 109.22,23.67 109.22,40.64 U$5.10
  Bottom 0.254: U2.6 111.76,20.73 v111.96,20.93
G-1
  Bottom 0.254: LED4.15 152.3,33.12 152.3,23.77 155.55,20.52 155.55,17.78 U5.P$19
G-2
  Bottom 0.254: LED3.15 60.86,33.12 60.86,23.57 60.35,23.06 60.35,19.1 U3.P$19
GND  (via drill 0.35, 0.55)
  Top 0.254: S2.1 196.29,16.56 196.29,19.61 197.31,20.62 197.31,33.22 196.29,34.24 S1.1 196.19,34.44 197.31,35.56 197.31,49.68 195.48,51.51 v195.48,57.3 J2.1 | 160.07,55.93 C24.P$2 162.56,58.42 D15.A | 160.07,55.93 155.25,51.1 146.91,51.1 146,52.02 144.78,52.02 C10.P$2 144.78,51.31 135.43,41.96 134.52,41.96 134.01,42.47 134.01,52.02 | 160.07,55.93 157.89,58.12 157.07,58.12 156.16,57.2 154.94,57.2 C21.P$2 154.84,57.2 143.05,57.2 140.72,59.54 135.33,59.54 134.62,58.83 D8.3 134.52,58.83 133.81,59.54 129.84,59.54 129.13,58.83 125.78,58.83 D7.3 125.58,58.73 123.75,58.73 122.94,59.54 117.55,59.54 116.84,58.83 D6.3 116.74,58.83 116.03,59.54 112.06,59.54 111.35,58.83 108,58.83 D5.3 107.8,58.73 105.97,58.73 105.16,59.54 99.77,59.54 99.06,58.83 D4.3 98.96,58.83 98.25,59.54 94.28,59.54 93.57,58.83 90.22,58.83 D3.3 90.02,58.73 89.2,59.54 85.45,59.54 84.73,58.83 81.28,58.83 D2.3 81.18,58.83 80.47,59.54 76.5,59.54 75.79,58.83 72.44,58.83 D1.3 | D25.3 143.46,11.79 141.53,11.79 140.72,12.6 135.43,12.6 134.62,11.79 D24.3 134.52,11.79 133.71,12.6 129.95,12.6 129.13,11.79 125.78,11.79 D23.3 125.58,11.79 123.75,11.79 122.94,12.6 117.65,12.6 116.84,11.79 D22.3 116.74,11.79 115.93,12.6 113.69,12.6 | 113.69,12.6 112.17,12.6 111.35,11.79 108,11.79 D21.3 107.8,11.79 106.98,12.6 103.23,12.6 102.51,11.89 99.06,11.89 D20.3 98.96,11.68 98.25,10.97 94.28,10.97 93.57,11.68 90.22,11.68 D13.3 90.02,11.79 88.19,11.79 87.38,12.6 82.09,12.6 81.28,11.79 D12.3 81.18,11.79 79.25,11.79 78.44,12.6 75.89,12.6 73.76,10.46 73.66,10.46 | 113.69,12.6 113.69,15.65
  Top 0.254: 113.69,15.65 v113.69,17.17 | 113.69,15.65 v112.98,15.65 | 73.66,10.46 73.66,8.94 | 73.66,8.94 73.66,7.72 | 73.66,7.72 C12.P$2 73.76,5.08 74.68,4.17 76.71,4.17 77.62,5.08 C1.P$2 82.6,4.98 83.41,4.17 85.55,4.17 86.46,5.08 C2.P$2 91.54,5.08 92.46,4.17 94.49,4.17 95.4,5.08 C13.P$2 100.38,4.98 101.19,4.17 103.33,4.17 104.24,5.08 C14.P$2 109.32,5.08 110.24,4.17 112.27,4.17 113.18,5.08 C15.P$2 118.16,4.98 118.97,4.17 121.11,4.17 122.02,5.08 C16.P$2 127.1,5.08 128.02,4.17 130.05,4.17 130.96,5.08 C17.P$2 135.94,4.98 136.75,4.17 138.89,4.17 139.8,5.08 C19.P$2 144.88,5.08 v145.8,5.99 | 73.66,10.46 72.44,11.68 D11.3 | v73.86,8.94 73.66,8.94 | 134.01,52.02 130.86,52.02 129.95,51.1 128.02,51.1 127.1,52.02 C8.P$2 127,52.02 122.02,52.02 121.11,51.1 119.08,51.1 C7.P$2 118.06,52.02 113.08,52.02 112.17,51.1 110.24,51.1 109.32,52.02 C6.P$2 109.22,52.02 104.24,52.02 103.33,51.1 101.3,51.1 C5.P$2 100.28,52.02 95.3,52.02 94.39,51.1 92.46,51.1 91.54,52.02 C4.P$2 91.44,52.02 86.46,52.02 85.55,51.1 83.52,51.1 C3.P$2 81.58,51.1 75.79,51.1 74.88,52.02 73.66,52.02 C18.P$2 73.56,52.02 69.8,52.02 66.24,48.46 53.34,48.46 U$4.STBY | 134.01,52.02 135.84,52.02 C9.P$2 | 41.15,33.12 41.15,20.73 40.03,19.61 40.03,16.56 S4.1 40.13,16.56 48.97,7.72 73.66,7.72 | 41.15,33.12 40.03,34.24 S3.1 39.93,34.34 38.81,35.46 16.36,35.46 4.88,46.94 v3.86,46.94 U$1.GND | 41.15,33.12 43.18,33.12 50.49,40.44 50.8,40.44 U$4.VSS
  Bottom 0.254: IC2.3 149.15,45.72 150.27,46.84 | 150.27,46.84 150.27,48.06 149.25,49.07 148.84,49.07 IC2.5 | 150.27,46.84 158.29,46.84 159.41,45.72 IC2.6 158.29,46.94 158.29,49.07 D15.A 167.74,58.42 168.76,57.4 v195.38,57.4 J2.1 | U2.13 109.22,14.53 110.03,15.34 112.17,15.34 112.42,15.09 | 112.42,15.09 112.98,14.53 112.98,14.02 U2.10 113.08,14.02 114.3,14.02 U2.9 | U2.8 114.3,17.78 v113.69,17.17 | v112.98,15.65 112.42,15.09 | v73.86,8.94 71.83,8.94 U3.P$1 | v145.8,5.99 166.01,5.99 166.93,6.91 166.93,7.62 U5.P$1 | U$1.AGND v3.86,59.74 v3.86,47.04 U$1.GND | U$4.VSS 50.8,45.82 53.34,48.36 U$4.STBY
LED_TACH_3V3  (via drill 0.35, 0.55)
  Top 0.254: v72.34,56.79 72.34,55.58 D1.4
  Bottom 0.254: v72.34,56.79 68.28,60.86 R12.1 R12.2 R13.1 61.87,61.06 59.64,63.3 21.13,63.3 20.52,62.69 20.52,62.18 11.48,53.14 v11.48,47.04 U$1.2
LED_WARN_3V3  (via drill 0.35, 0.55)
  Top 0.254: 71.22,12.39 71.22,11.07 72.34,9.96 72.34,8.64 D11.4 | v75.29,16.46 71.22,12.39 | 71.22,12.39 69.19,12.39 61.06,20.52 61.06,24.49 55.98,29.57 55.98,40.13 51.61,44.5 25.09,44.5 22.66,46.94 v21.64,46.94 U$1.6
  Bottom 0.254: R16.1 88.49,16.56 87.48,17.58 84.63,17.58 83.62,16.56 R15.1 83.41,16.56 81.69,16.56 R15.2 81.48,16.46 v75.29,16.46
N$1
  Bottom 0.254: 147.01,19.1 147.01,20.32 R2.1 | 147.01,19.1 147.01,16.56 R3.1 | 147.01,19.1 141.02,19.1 D10.C
N$2
  Top 0.254: D1.2 77.52,58.73 78.03,58.73 81.18,55.58 D2.4
N$4
  Bottom 0.254: C22.P$2 82.7,20.32 81.48,19.1 71.83,19.1 U3.P$28
N$5
  Top 0.254: D12.2 86.46,11.68 87.07,11.68 90.12,8.64 D13.4
N$6
  Top 0.254: D7.2 130.86,58.73 131.37,58.73 134.52,55.58 D8.4
N$7
  Top 0.254: D8.2 139.8,58.73 140.31,58.73 143.46,55.58 D9.4
N$11
  Top 0.254: D11.2 77.52,11.68 78.13,11.68 81.18,8.64 D12.4
N$12
  Bottom 0.254: U$2.P$1 142.44,42.98 143.46,43.99 148.74,43.99 IC2.2 148.95,43.99 149.76,44.81 151.28,44.81 156.06,40.03 163.17,40.03 167.64,44.5 D15.C
N$13
  Top 0.254: D2.2 86.46,58.73 86.97,58.73 90.12,55.58 D3.4
N$14
  Top 0.254: D3.2 95.3,58.73 95.81,58.73 98.96,55.58 D4.4
N$15
  Top 0.254: D4.2 104.24,58.73 104.75,58.73 107.9,55.58 D5.4
N$16
  Top 0.254: D5.2 113.08,58.73 113.59,58.73 116.74,55.58 D6.4
N$17
  Top 0.254: D6.2 122.02,58.73 122.53,58.73 125.68,55.58 D7.4
N$21
  Top 0.254: D20.2 104.24,11.68 104.85,11.68 107.9,8.64 D21.4
N$22
  Top 0.254: D21.2 113.08,11.68 113.69,11.68 116.74,8.64 D22.4
N$23
  Top 0.254: D22.2 122.02,11.68 122.63,11.68 125.68,8.64 D23.4
N$24
  Top 0.254: D23.2 130.86,11.68 131.47,11.68 134.52,8.64 D24.4
N$25
  Top 0.254: D24.2 139.8,11.68 140.41,11.68 143.46,8.64 D25.4
SCL  (via drill 0.35, 0.55)
  Top 0.254: v16.26,31.9 v16.26,27.13 17.48,27.13 v37.59,7.01
  Bottom 0.254: v16.26,27.13 15.85,26.72 14.94,26.72 R5.1 | v16.26,31.9 16.26,45.11 15.04,46.33 v15.04,55.68 U$1.19/A5 | 71.12,7.62 71.12,10.77 69.29,12.6 69.29,19 U3.P$26 | 71.12,7.62 70.51,7.01 v37.59,7.01 | U5.P$26 164.49,17.78 164.49,18.49 165.2,19.2 167.54,19.2 168.05,18.69 168.05,6.1 166.73,4.78 73.86,4.78 71.12,7.52 71.12,7.62
SDA  (via drill 0.35)
  Bottom 0.254: R4.1 19.91,26.72 19.91,42.06 15.44,46.53 v15.44,53.54 U$1.18/A4 v25.2,61.16 43.48,61.16 65.94,38.71 65.94,33.93 71.02,28.85 71.02,23.57 70.51,23.06 70.51,19.1 U3.P$27 70.51,19 70.51,18.39 83.72,5.18 166.52,5.18 167.64,6.3 167.64,8.94 165.81,10.77 165.81,17.78 U5.P$27
VDD12V_DASH  (via drill 0.35, 0.55)
  Top 0.508: J2.2 v199.34,57.4 197.61,59.13 193.95,59.13 191.52,56.69 167.13,56.69 166.73,57.1 163.88,57.1 C24.P$1 163.88,56.9 v150.98,43.99
  Bottom 0.508: v150.98,43.99 149.35,42.37 148.84,42.37 IC2.1
VDD_3V3  (via drill 0.35)
  Top 0.254: U$1.3.3V v8.94,62.28 9.96,62.28 10.97,63.3 29.67,63.3 30.68,62.28 30.68,61.77 43.99,48.46 45.72,48.46 U$4.SPLIT
  Bottom 0.254: R6.2 188.26,27.94 188.26,10.16 R7.2 172.72,10.16 166.93,4.37 36.58,4.37 32.11,8.84 R14.2 32.11,8.94 32.11,26.82 | 32.11,26.82 32.11,27.94 R11.2 | 32.11,26.82 39.42,26.82 51.92,39.32 51.92,41.35 54.46,43.89 54.46,49.58 53.75,50.29 47.85,50.29 46.02,48.46 45.72,48.46 U$4.SPLIT
VIN  (via drill 0.35, 0.55)
  Top 0.508: 147.32,7.32 C19.P$1 | 147.32,7.32 148.54,8.53 D25.1 | 138.48,7.32 138.48,5.08 C17.P$1 | 138.48,7.32 139.7,8.53 D24.1 139.9,8.43 140.92,7.42 147.12,7.42 147.32,7.32 | 129.54,7.32 C16.P$1 | 129.54,7.32 130.76,8.53 D23.1 131.06,8.43 132.08,7.42 138.28,7.42 138.48,7.32 | 120.7,7.32 120.7,5.08 C15.P$1 | 120.7,7.32 121.92,8.53 D22.1 122.12,8.43 123.14,7.42 129.34,7.42 129.54,7.32 | 111.76,7.32 C14.P$1 | 111.76,7.32 112.98,8.53 D21.1 113.28,8.43 114.3,7.42 120.5,7.42 120.7,7.32 | 102.92,7.32 102.92,5.08 C13.P$1 | 102.92,7.32 104.14,8.53 D20.1 104.34,8.43 105.36,7.42 111.56,7.42 111.76,7.32 | 93.98,7.32 C2.P$1 | 93.98,7.32 95.2,8.53 D13.1 95.5,8.43 96.52,7.42 102.72,7.42 102.92,7.32 | C12.P$1 76.2,7.32 77.42,8.53 D11.1 77.72,8.43 79.45,8.43 80.47,7.42 84.94,7.42 85.14,7.32 | 85.14,7.32 85.14,5.08 C1.P$1 | 85.14,7.32 86.36,8.53 D12.1 | 93.98,7.32 93.78,7.42 87.58,7.42 86.56,8.43 D12.1 | v87.58,9.75 86.56,8.74 D12.1 | 147.32,54.25 C10.P$1 | 147.32,54.25 148.54,55.47 D9.1 148.84,55.68 155.45,55.68 156.87,57.1 157.48,57.1 C21.P$1 | 138.48,54.25 138.48,52.12 C9.P$1 135.03,48.67 135.03,42.98 U$2.P$2 | 138.48,54.25 139.7,55.47 D8.1 139.9,55.37 140.92,54.36 147.12,54.36 147.32,54.25 | 129.54,54.25 C8.P$1 | 129.54,54.25 130.76,55.47 D7.1 131.06,55.47 132.18,54.36 138.28,54.36 138.48,54.25 | 120.7,54.25 120.7,52.12 C7.P$1 | 120.7,54.25 121.92,55.47 D6.1 122.12,55.37 123.14,54.36 129.34,54.36 129.54,54.25 | 111.76,54.25 C6.P$1 | 111.76,54.25 112.98,55.47 D5.1 113.28,55.47 114.4,54.36 120.5,54.36 120.7,54.25 | 102.92,54.25 102.92,52.12 C5.P$1 | 102.92,54.25 104.14,55.47 D4.1 104.34,55.37 105.36,54.36 111.56,54.36 111.76,54.25
  Top 0.508: 93.98,54.25 C4.P$1 | 93.98,54.25 95.2,55.47 D3.1 95.5,55.47 96.62,54.36 102.72,54.36 102.92,54.25 | 85.14,54.25 85.14,52.12 C3.P$1 | 85.14,54.25 86.36,55.47 D2.1 86.56,55.37 87.58,54.36 93.78,54.36 93.98,54.25 | 76.2,54.25 C18.P$1 | 76.2,54.25 77.42,55.47 D1.1 77.72,55.47 78.84,54.36 84.94,54.36 85.14,54.25 | 76.2,54.25 76,54.36 v66.45,54.36 66.24,54.46 56.79,63.91 6.4,63.91 4.78,62.28 v3.86,62.28 U$1.VIN
  Bottom 0.508: C22.P$1 81.89,20.32 83.01,21.44 | 83.01,21.44 85.65,21.44 89.71,17.37 89.71,15.65 89.41,15.34 87.68,15.34 | 87.68,15.34 86.77,16.26 86.77,16.46 R16.2 | v87.58,9.75 87.58,15.14 87.68,15.34 | 14.22,28.04 13.11,26.92 13.11,26.72 R5.2 | 14.22,28.04 16.76,28.04 18.09,26.72 R4.2 | U$1.VIN v3.76,62.18 3.76,60.45 2.64,59.33 2.64,39.73 14.12,28.25 14.22,28.04 | IC2.4 148.74,47.35 139.4,47.35 135.03,42.98 U$2.P$2 | R13.2 60.05,60.96 60.05,60.76 v66.45,54.36 66.34,54.15 66.04,53.85 66.04,49.89 82.91,33.02 82.91,21.64 83.01,21.44
X
  Bottom 0.254: U$5.5 113.08,21.64 113.08,18.8 U2.7
(copper drawn outside any net)
  shapes: Top area x2

### Text on the board
tPlace: Lehigh FSAE X50 Dash Rev 1 | RPM | Gear Position | Neutral | ALED | WLED | DAQ Power | DAQ Log | DAQ Status | Shift No Work | Tach Out | STG 2 | * Made In Mohler By Pixies *